# EAGLE design atom-hub-proto-self-Vorlage (EAGLE 7.7.0)
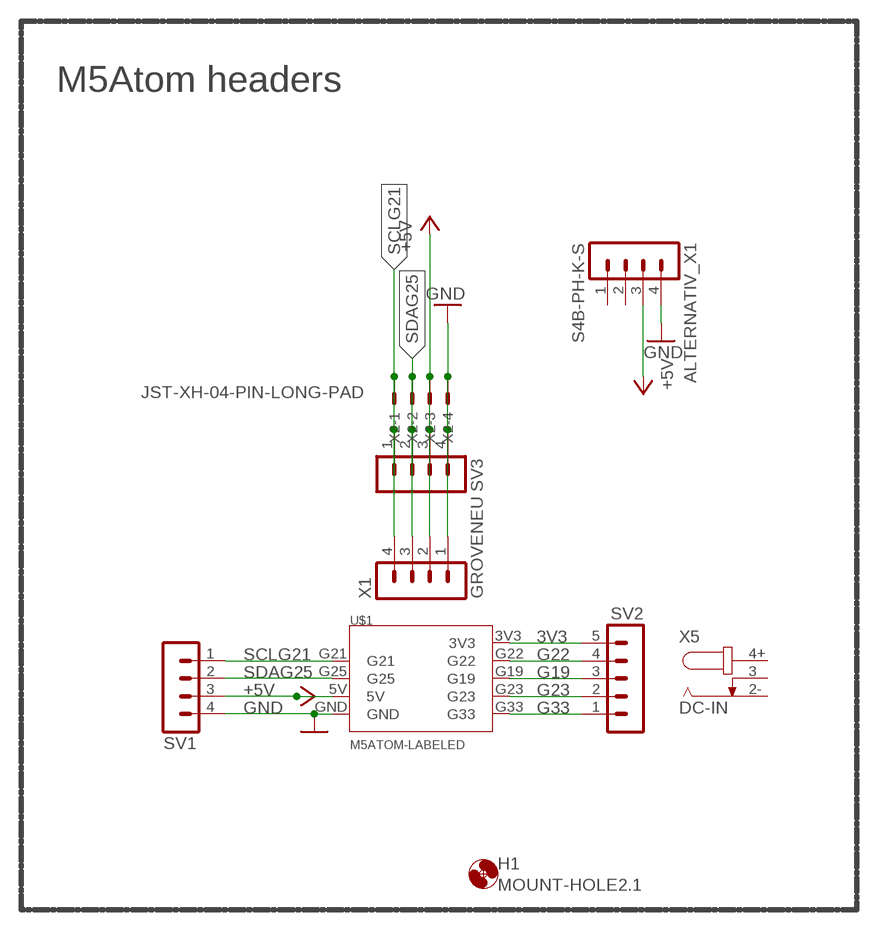
[diagram p0: schematic, sheet 1]

## Parts
ALTERNATIV_X1  S4B-PH-K-S  [S4B-PH-K-S]
H1  MOUNT-HOLE2.1  [2,1]
SV1  MA04-1  [MA04-1]
SV2  MA05-1  [MA05-1]
SV3  MA04-1  [MA04-1]
U$1  M5ATOM-LABELED  [M5ATOM-W/-LABELS]
X1  GROVENEU  [GROVE-NEU]
X2  JST-XH-04-PIN-LONG-PAD  [JST-XH-04-PACKAGE-LONG-PAD]
X5  DC-IN  [DC-IN-TH_DC-0440-2.5A-2.0]

## Nets
3V3: SV2.5 U$1.3V3
+5V: ALTERNATIV_X1.3 SV1.3 SV3.3 U$1.5V X1.2 X2.3
G19: SV2.3 U$1.G19
G22: SV2.4 U$1.G22
G23: SV2.2 U$1.G23
G33: SV2.1 U$1.G33
GND: ALTERNATIV_X1.4 SV1.4 SV3.4 U$1.GND X1.1 X2.4
SCLG21: SV1.1 SV3.1 U$1.G21 X1.4 X2.1
SDAG25: SV1.2 SV3.2 U$1.G25 X1.3 X2.2
Unconnected: ALTERNATIV_X1.1 ALTERNATIV_X1.2 X5.2- X5.3 X5.4+

## Notes on the sheet
- M5Atom headers

## Library data of the parts
ALTERNATIV_X1 = con-JST PH:S4B-PH: JST PH series header 2.00mm pitch disconnectable crimp style connectors, horizontal (side entry type), 4 pins
H1 = holes:MOUNT-HOLE: MOUNTING HOLE with drill center marker
SV1 SV3 = con-lstb:MA04-1: PIN HEADER; OC_FARNELL: unknown; OC_NEWARK: unknown
SV2 = con-lstb:MA05-1: PIN HEADER; OC_FARNELL: unknown; OC_NEWARK: unknown
U$1 = M5Atom:M5ATOM: Design for M5Atom Series
X1 = common:GROVE
X2 = con-JST-XH_Rembrandt Electronics-v1-0:JST-XH-04-PIN: JST XH Connector 2 Pin Wire to board connector. Pitch: 2,54 mm, (0.100") Number of pins: 4 Created by Rembrandt Electronics www.rembrandtelectronics.com
X5 = common:DC-IN

## Net classes
0 default: width 0.15 mm, drill 0.3 mm, clearance 0.15 mm

## Board
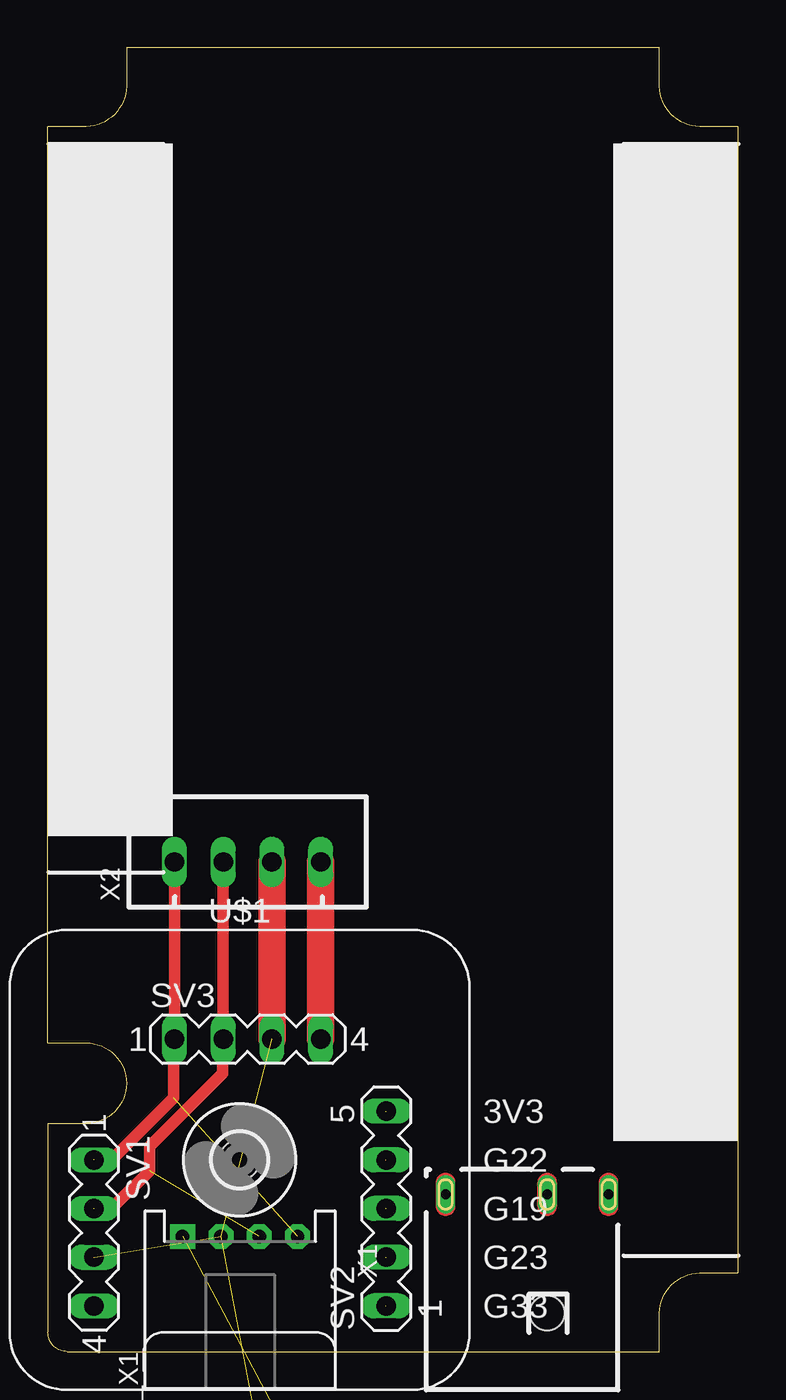
[diagram p1: board, top side]
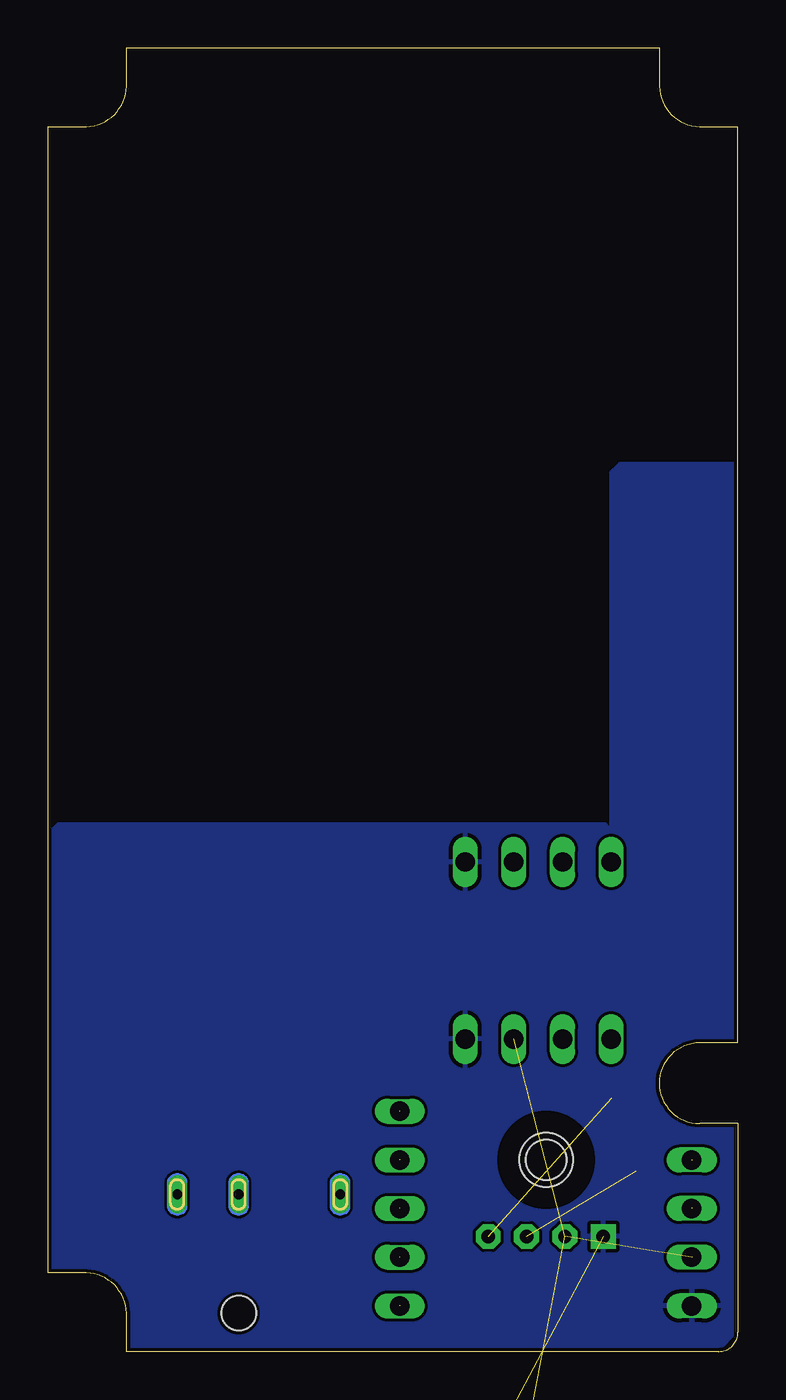
[diagram p2: board, bottom side, seen from below]

Size 36 x 68 mm. Coordinates in mm from the lower left corner, seen from the top.
Outline: 1,0 31.9,0 31.9,2 arc-87 34,4.1 36,4.1 36,63.9 34,63.9 arc-87 31.9,66 31.9,68 4.1,68 4.1,66 arc-87 2,63.9 0,63.9 0,16.1 2,16.1 arc-180 2,11.9 0,11.9 0,1 arc90 1,0
Copper layers (1*16): Top 0.035mm / dielectric 1.5mm / Bottom 0.035mm
Design rules "Eagle-DRU - 1506 - LeitOn - 01 and 02 layers - STANDARD": minimum track width 0.15mm, minimum drill 0.3mm, track to track 0.15mm, track to pad 0.15mm, pad to pad 0.15mm, via to via 0.15mm, smd to smd 0.15mm, copper to edge 0.2mm, drill to drill 0.25mm, minimum pad ring 0.15mm, minimum via ring 0.15mm, stop-mask expansion 0.05mm, vias tented up to drill 0mil, thermal gap 0.2mm
vRestrict: 24 lines

### Footprints (pad centres in the part's own frame; a part is rotated, then mirrored left to right if it is on the bottom)
S4B-PH-K-S = drill 0.7 pad 1.3 square: 1 3,0 | drill 0.7 pad 1.3 octagon: 2 1,0; 3 -1,0; 4 -3,0
2,1 = hole 2.8: 0,0
MA04-1 = drill 1.016 long: 1 -3.81,0; 2 -1.27,0; 3 1.27,0; 4 3.81,0
MA05-1 = drill 1.016 long: 1 -5.08,0; 2 -2.54,0; 3 0,0; 4 2.54,0; 5 5.08,0
M5ATOM-W/-LABELS = drill 0.8: 3V3 7.62,2.54; 5V -7.62,-5.08; G19 7.62,-2.54; G21 -7.62,0; G22 7.62,0; G23 7.62,-5.08; G25 -7.62,-2.54; G33 7.62,-7.62; GND -7.62,-7.62 | hole 2.1: 0,0
GROVE-NEU = drill 0.7 pad 1.3 square: 1 -6.2,-3 | drill 0.7 pad 1.3 octagon: 2 -6.2,-1; 3 -6.2,1; 4 -6.2,3
JST-XH-04-PACKAGE-LONG-PAD = drill 1.016 long: 1 -3.81,0; 2 -1.27,0; 3 1.27,0; 4 3.81,0
DC-IN-TH_DC-0440-2.5A-2.0 = drill 0.5 pad 1 long: 2- 0,4.25; 3 0,-1.05; 4+ 0,-4.25 | hole 1.8: -6.2,-1.046

### Placement (x,y rotation side)
ALTERNATIV_X1  10.26,-5.7 180 top  (outside the outline)
H1  10,10 0 top
SV1  2.41,6.19 270 top
SV2  17.65,7.46 90 top
SV3  10.42,16.3 0 top
U$1  10,10 0 top
X1  10.03,-0.2 270 top
X2  10.42,25.54 0 top
X5  25,8.2 90 top

### Tracks (layer width: path | path; a pad name or v marks a point on that pad's centre or on a via)
3V3  (1 unrouted)
+5V  (4 unrouted)
  Top 1.422: X2.3 SV3.3
G19  (1 unrouted)
G22  (1 unrouted)
G23  (1 unrouted)
G33  (1 unrouted)
GND  (1 unrouted)
  Top 1.422: X2.4 SV3.4
  pour Bottom: 0,1 1,0 31.7,0 31.9,0.2 32.2,0.2 36,4 36,27.1 35.5,27.6 6.9,27.6 6.7,27.4 6.7,45.9 6.3,46.3 6.2,46.4 0,46.4
SCLG21  (2 unrouted)
  Top 0.61: SV1.1 3.33,10 6.57,13.24 6.57,16.26 SV3.1 X2.1
  Bottom 0.61: 3.33,10 SV1.1
SDAG25  (2 unrouted)
  Top 0.61: U$1.G25 3.33,7.46 5.3,9.43 5.3,10.7 9.11,14.51 9.11,16.26 SV3.2 X2.2